# EAGLE design Maduino LoRa Radio v2.1 (EAGLE 6.1)
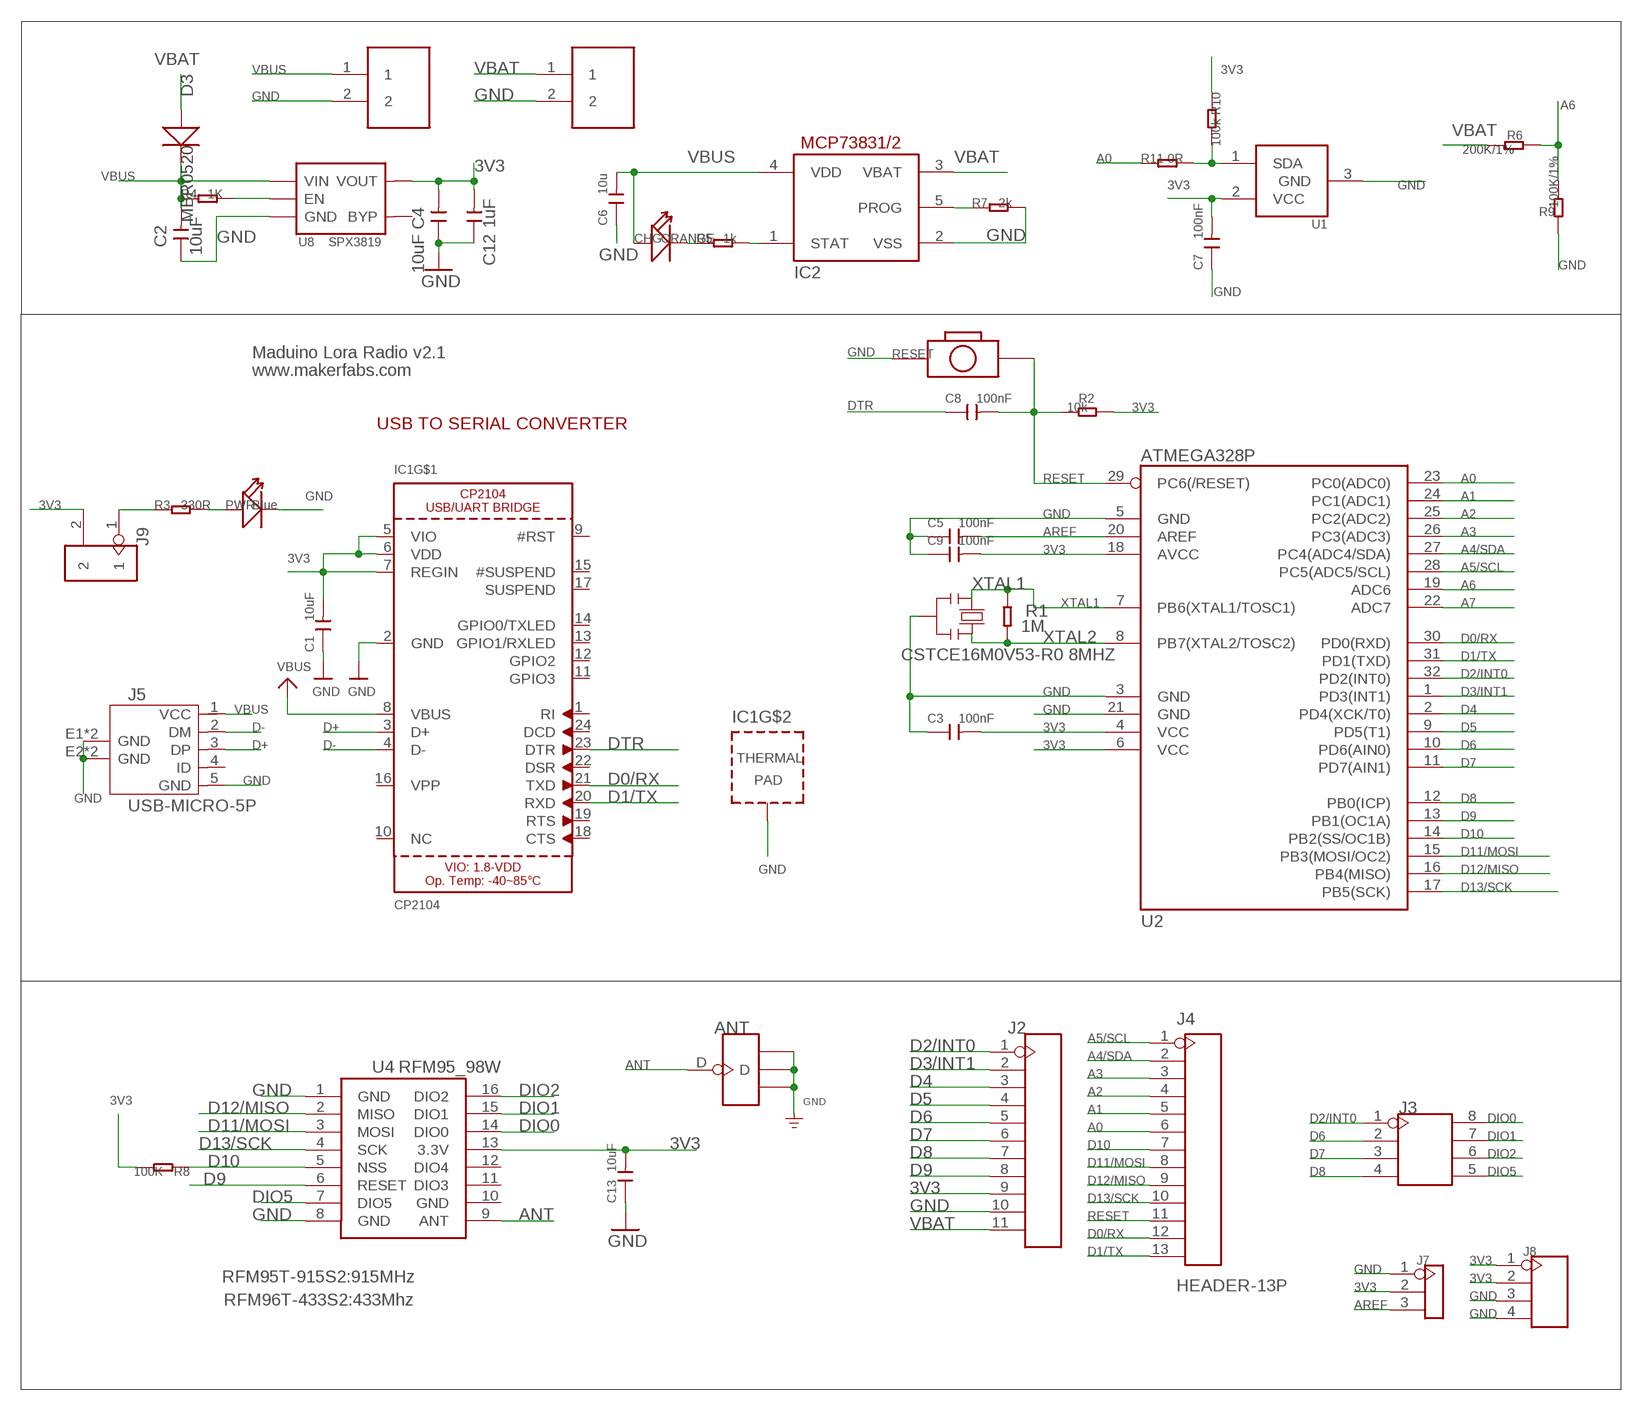
[diagram p0: schematic, sheet 1]

## Parts
ANT  ANTENNA-U-FL  [4P-U-FL]
C1  10uF  C-0603  [0603]
C2  10uF  C-0603  [0603]
C3  100nF  C-0603  [0603]
C4  10uF  C-0603  [0603]
C5  100nF  C-0603  [0603]
C6  10u  C-0603  [0603]
C7  100nF  C-0603  [0603]
C8  100nF  C-0603  [0603]
C9  100nF  C-0603  [0603]
C12  1uF  C-0603  [0603]
C13  10uF  C-0603  [0603]
CHG  ORANGE  007-LED0603  [D0603]
D3  MBR0520  D'1206'  [SOD123]
IC1  CP2104  [QFN24_4MM_SMSC]
IC2  MCP73831/OT  [SOT23-5L]
J1  PH2.0-2P-90-DIP  [PH2.0-2P-90-DIP]
J2  HEADER-11P-2.54  [11P-2.54]
J3  HEADER-2X4P-2.54  [2X4P-2.54]
J4  HEADER-13P  [13P-2.54]
J5  USB-MICRO-5P  [MICRO-USB-5P]
J6  PH2.0-2P-90-DIP  [PH2.0-2P-90-DIP]
J7  HEADER-3P-2.54  [3P-2.54]
J8  HEADER-4P-60/35MILROUND  [4P-65/35ROUND]
J9  HEADER-2P-2.0  [2P-2.0]
PWR  Blue  LED'0603'  [LED-0603]
R1  1M  R-0603  [R0603]
R2  10k  R-0603  [R0603]
R3  330R  R-0603  [R0603]
R4  1K  R-0603  [R0603]
R5  1k  R-0603  [R0603]
R6  200K/1%  R-0603  [R0603]
R7  2k  R-0603  [R0603]
R8  100K  R-0603  [R0603]
R9  100K/1%  R-0603  [R0603]
R10  100k  R-0603  [R0603]
R11  0R  R-0603  [R0603]
RESET  BOTTON-2P-90D  [2P-7.62X3.56-90D]
U1  IC_ATSHA204A_CRYPT  [SOT23-3]
U2  ATMEGA328P  ATMEGA8/168/328  [TQFP32]
U4  RFM95_98W  RFM92_93W  [RFM92_93W]
U8  SPX3819  [SOT23-5]
Y1  CSTCE16M0V53-R0 8MHZ  RESONATORMU  [RESONATOR]

## Nets
3V3: C1.2 C3.2 C4.2 C7.2 C9.2 C12.2 C13.2 IC1.5(VIO) IC1.6(VDD) IC1.7(REGIN) J2.9 J7.2 J8.1 J8.2 J9.2 R2.1 R8.2 R10.1 U1.2(VCC) U2.4(VCC) U2.6(VCC) U2.18(AVCC) U4.13(3.3V) U8.5(VOUT)
A0: J4.6 R11.1 U2.23(PC0(ADC0))
A1: J4.5 U2.24(PC1(ADC1))
A2: J4.4 U2.25(PC2(ADC2))
A3: J4.3 U2.26(PC3(ADC3))
A4/SDA: J4.2 U2.27(PC4(ADC4/SDA))
A5/SCL: J4.1 U2.28(PC5(ADC5/SCL))
A6: R6.1 R9.2 U2.19(ADC6)
A7: U2.22(ADC7)
ANT: ANT.D U4.9(ANT)
AREF: C5.2 J7.3 U2.20(AREF)
D0/RX: IC1.21(TXD) J4.12 U2.30(PD0(RXD))
D1/TX: IC1.20(RXD) J4.13 U2.31(PD1(TXD))
D2/INT0: J2.1 J3.1 U2.32(PD2(INT0))
D3/INT1: J2.2 U2.1(PD3(INT1))
D4: J2.3 U2.2(PD4(XCK/T0))
D5: J2.4 U2.9(PD5(T1))
D6: J2.5 J3.2 U2.10(PD6(AIN0))
D7: J2.6 J3.3 U2.11(PD7(AIN1))
D8: J2.7 J3.4 U2.12(PB0(ICP))
D9: J2.8 U2.13(PB1(OC1A)) U4.6(RESET)
D10: J4.7 R8.1 U2.14(PB2(SS/OC1B)) U4.5(NSS)
D11/MOSI: J4.8 U2.15(PB3(MOSI/OC2)) U4.3(MOSI)
D12/MISO: J4.9 U2.16(PB4(MISO)) U4.2(MISO)
D13/SCK: J4.10 U2.17(PB5(SCK)) U4.4(SCK)
D+: IC1.3(D+) J5.3(DP)
D-: IC1.4(D-) J5.2(DM)
DIO0: J3.8 U4.14(DIO0)
DIO1: J3.7 U4.15(DIO1)
DIO2: J3.6 U4.16(DIO2)
DIO5: J3.5 U4.7(DIO5)
DTR: C8.1 IC1.23(DTR)
GND: ANT.GND1 ANT.GND2 ANT.GND3 C1.1 C2.1 C3.1 C4.1 C5.1 C6.1 C7.1 C9.1 C12.1 C13.1 IC1.2(GND) IC1.THERM(TP) IC2.2(VSS) J1.2 J2.10 J5.5(GND) J5.E1(GND) J5.E2(GND) J5.P1(GND) J5.P2(GND) J6.2 J7.1 J8.3 J8.4 PWR.- R7.2 R9.1 RESET.P$1 U1.3(GND) U2.3(GND) U2.5(GND) U2.21(GND) U4.1(GND) U4.8(GND) U8.2(GND) Y1.2
N$1: J9.1 R3.1
N$2: R10.2 R11.2 U1.1(SDA)
N$7: PWR.+ R3.2
N$24: R4.2 U8.3(EN)
N$25: CHG.- R5.1
N$26: IC2.1(STAT) R5.2
N$31: IC2.5(PROG) R7.1
RESET: C8.2 J4.11 R2.2 RESET.P$2 U2.29(PC6(/RESET))
VBAT: D3.+ IC2.3(VBAT) J2.11 J6.1 R6.2
VBUS: C2.2 C6.2 CHG.+ D3.- IC1.8(VBUS) IC2.4(VDD) J1.1 J5.1(VCC) R4.1 U8.1(VIN)
XTAL1: R1.2 U2.7(PB6(XTAL1/TOSC1)) Y1.1
XTAL2: R1.1 U2.8(PB7(XTAL2/TOSC2)) Y1.3
Unconnected: IC1.1(RI) IC1.9(#RST) IC1.10(NC) IC1.11(GPIO3) IC1.12(GPIO2) IC1.13(GPIO1/RXLED) IC1.14(GPIO0/TXLED) IC1.15(#SUSPEND) IC1.16(VPP) IC1.17(SUSPEND) IC1.18(CTS) IC1.19(RTS) IC1.22(DSR) IC1.24(DCD) J5.4(ID) U4.11(DIO3) U4.12(DIO4) U8.4(BYP)

## Notes on the sheet
- Maduino Lora Radio v2.1
- www.makerfabs.com
- USB TO SERIAL CONVERTER
- RFM95T-915S2:915MHz
- RFM96T-433S2:433Mhz

## Power pins joined to a net without a drawn wire
GND: U4.10(GND)

## Library data of the parts
ANT = Connector:ANTENNA-U-FL
C1-C9 C12 C13 = Discrete:C*: Ceramic Capacitors
CHG = Discrete:007-LED*
D3 = Discrete:D*
IC1 = microbuilder:CP2104: CP2104 - USB to UART Bridge VDD Output: 3.45V
IC2 = adafruit:MCP73831: MCP73831/2 Miniature Single-Cell, Fully Integrated Li-Ion, Li-Polymer Charge Management Controllers. Nice and small simple lipoly charge controller, with adjustable current and status output (LED) http://www.ladyada.net/library/pcb/eaglelibrary.html
J1 J6 = Connector:PH2.0-2P-90-DIP
J2 = Connector:HEADER-11P
J3 = Connector:HEADER-2X4P
J4 = Connector:HEADER-13P
J5 = Connector:USB-MICRO-5P
J7 = Connector:HEADER-3P
J8 = Connector:HEADER-4P
J9 = Connector:HEADER-2P
PWR = Discrete:LED*
R1-R11 = Discrete:R*
RESET = Discrete:BOTTON-2P
U1 = TD-MySensors:IC_ATSHA204A_CRYPT
U2 = IC:ATMEGA8/168/328: MICROCONTROLLER
U4 = dragino:RFM92_93W
U8 = IC:SPX3819
Y1 = SmartPrj:RESONATOR

## Net classes
0 default: width 0.152 mm, drill 0.152 mm, clearance 0.152 mm
2 gnd: width 0.305 mm, drill 0.559 mm, clearance 0.254 mm
3 usbvcc: width 0.508 mm, drill 0.61 mm, clearance 0.254 mm

## Board
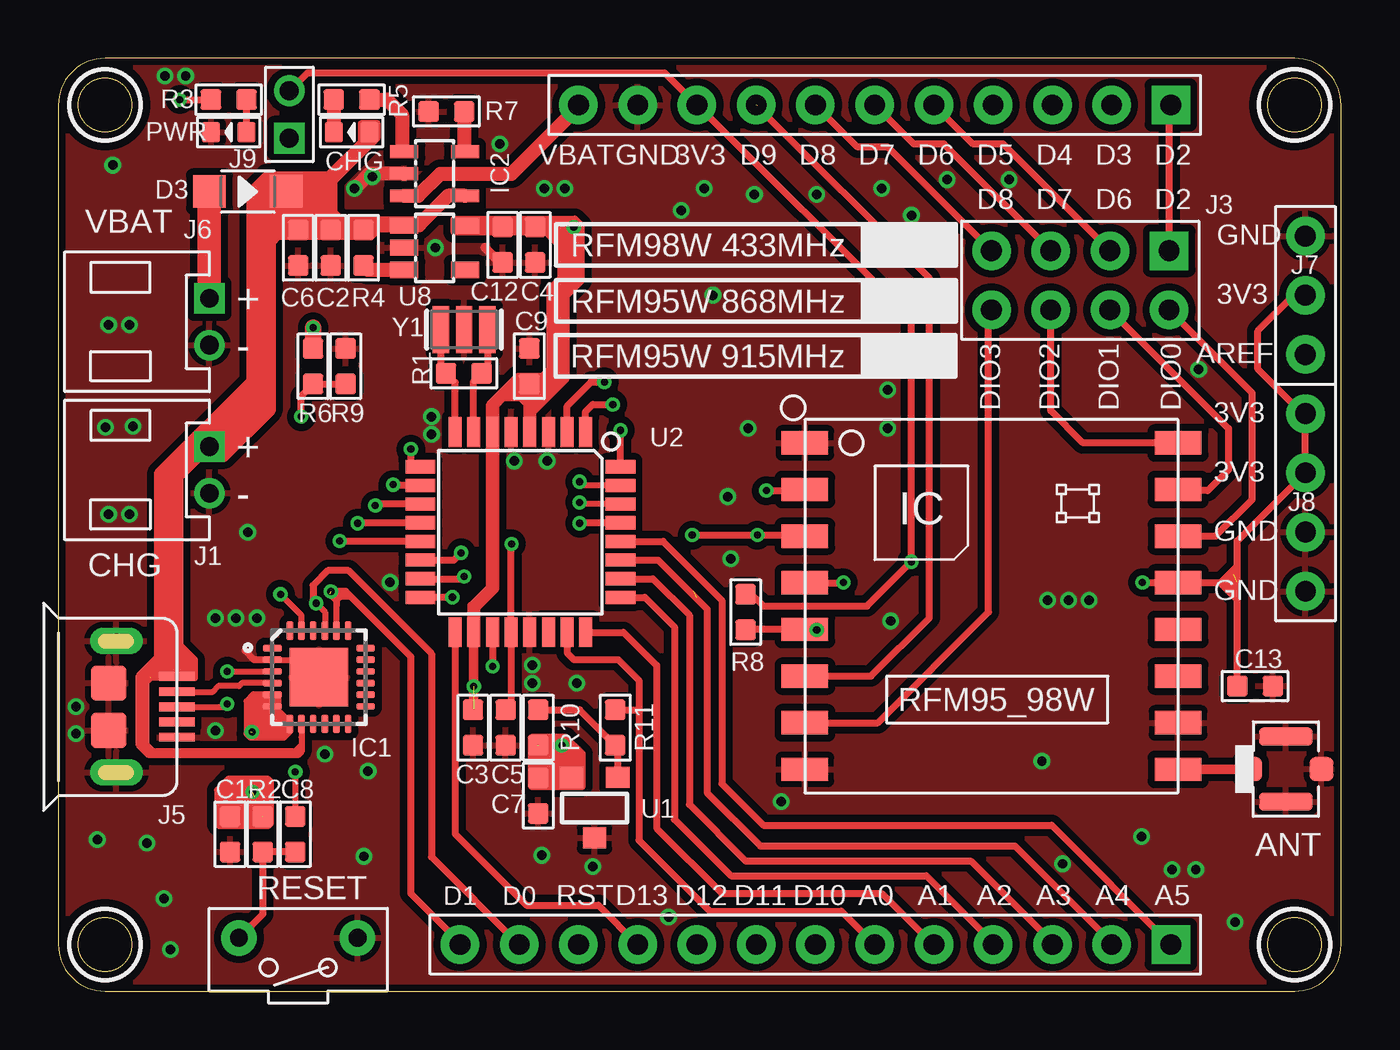
[diagram p1: board, top side]
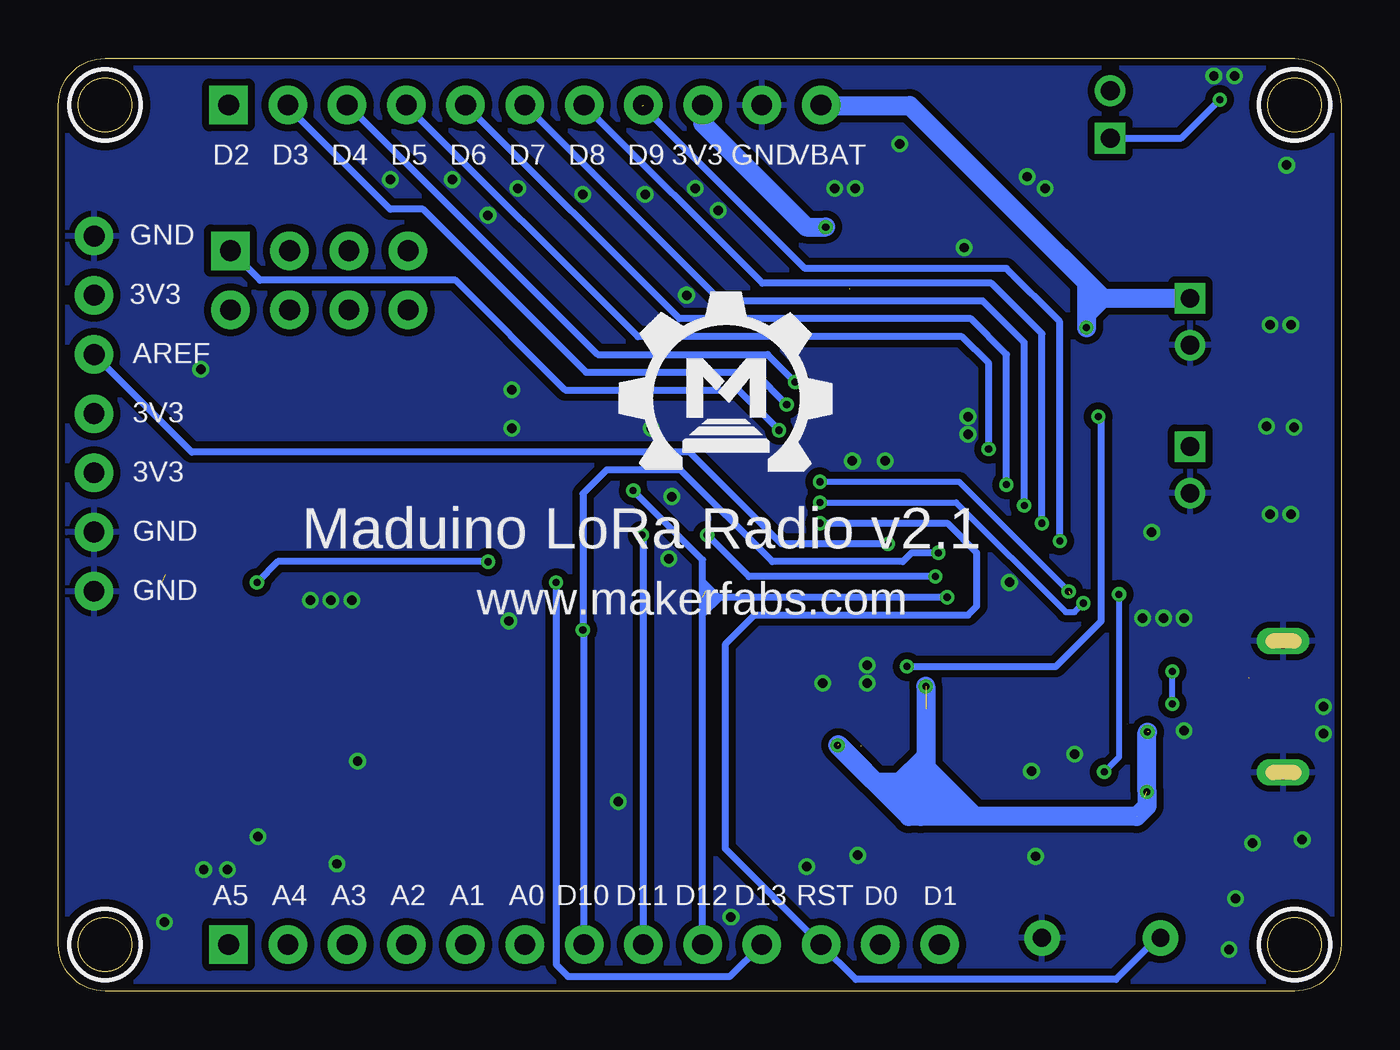
[diagram p2: board, bottom side, seen from below]

Size 55 x 40 mm. Coordinates in mm from the lower left corner, seen from the top.
Outline: 0,38 0,2 arc90 2,0 53,0 arc90 55,2 55,38 arc90 53,40 2,40 arc90 0,38
Outline: circle at 53,2 radius 1.14
Outline: circle at 53,38 radius 1.14
Outline: circle at 2,2 radius 1.14
Outline: circle at 2,38 radius 1.14
Copper layers (1*16): Top 0.035mm / dielectric 1.5mm / Bottom 0.035mm
Design rules: minimum track width 6mil, minimum drill 12mil, track to track 6mil, track to pad 6mil, pad to pad 6mil, via to via 6mil, smd to smd 0mil, copper to edge 10mil, drill to drill 10mil, minimum pad ring 10mil, minimum via ring 6mil, stop-mask expansion 2mil, vias tented up to drill 100mil, thermal gap 10mil
tRestrict: area 51.5,0.5 to 54.5,3.5; area 51.5,36.5 to 54.5,39.5; area 0.5,0.5 to 3.5,3.5; area 0.5,36.5 to 3.5,39.5
bRestrict: area 51.5,0.5 to 54.5,3.5; area 51.5,36.5 to 54.5,39.5; area 0.5,0.5 to 3.5,3.5; area 0.5,36.5 to 3.5,39.5

### Footprints (pad centres in the part's own frame; a part is rotated, then mirrored left to right if it is on the bottom)
4P-U-FL = smd 1.016 x 1.016: D -1.524,0; GND3 1.524,0 | smd 2.286 x 0.762: GND1 0,1.397; GND2 0,-1.397
0603 = smd 0.889 x 0.889: 1 -0.762,0; 2 0.762,0
D0603 = smd 0.762 x 0.889: + -0.762,0; - 0.762,0
SOD123 = smd 1.397 x 1.397: + -1.651,0; - 1.651,0
QFN24_4MM_SMSC = smd 0.8 x 0.28: 1 -2,1.25; 2 -2,0.75; 3 -2,0.25; 4 -2,-0.25; 5 -2,-0.75; 6 -2,-1.25; 13 2,-1.25; 14 2,-0.75; 15 2,-0.25; 16 2,0.25; 17 2,0.75; 18 2,1.25 | smd 0.28 x 0.8: 7 -1.25,-2; 8 -0.75,-2; 9 -0.25,-2; 10 0.25,-2; 11 0.75,-2; 12 1.25,-2; 19 1.25,2; 20 0.75,2; 21 0.25,2; 22 -0.25,2; 23 -0.75,2; 24 -1.25,2 | smd 2.5 x 2.5: THERM 0,0
SOT23-5L = smd 0.55 x 1.2: 1 -0.95,-1.3; 2 0,-1.3; 3 0.95,-1.3; 4 0.95,1.3; 5 -0.95,1.3
PH2.0-2P-90-DIP = drill 0.8 square: 1 0,1 | drill 0.8: 2 0,-1
11P-2.54 = drill 0.889 pad 1.651 square: 1 0,12.7 | drill 0.889 pad 1.651: 2 0,10.16; 3 0,7.62; 4 0,5.08; 5 0,2.54; 6 0,0; 7 0,-2.54; 8 0,-5.08; 9 0,-7.62; 10 0,-10.16; 11 0,-12.7
2X4P-2.54 = drill 0.889 pad 1.651 square: 1 -1.27,3.81 | drill 0.889 pad 1.651: 2 -1.27,1.27; 3 -1.27,-1.27; 4 -1.27,-3.81; 5 1.27,-3.81; 6 1.27,-1.27; 7 1.27,1.27; 8 1.27,3.81
13P-2.54 = drill 0.889 pad 1.651 square: 1 0,15.24 | drill 0.889 pad 1.651: 2 0,12.7; 3 0,10.16; 4 0,7.62; 5 0,5.08; 6 0,2.54; 7 0,0; 8 0,-2.54; 9 0,-5.08; 10 0,-7.62; 11 0,-10.16; 12 0,-12.7; 13 0,-15.24
MICRO-USB-5P = smd 0.38 x 1.52: 1 -1.3,0; 2 -0.65,0; 3 0,0; 4 0.65,0; 5 1.3,0 | smd 1.524 x 1.524: E1 -1.016,-2.921; E2 1.016,-2.921 | drill 0.635 pad 1.143 long: P1 -2.819,-2.591; P2 2.819,-2.591
3P-2.54 = drill 0.9 pad 1.651: 1 0,2.54; 2 0,0; 3 0,-2.54
4P-65/35ROUND = drill 0.889 pad 1.651: 1 0,3.81; 2 0,1.27; 3 0,-1.27; 4 0,-3.81
2P-2.0 = drill 0.813 pad 1.27 square: 1 -1.016,0 | drill 0.813 pad 1.27: 2 1.016,0
LED-0603 = smd 0.762 x 0.889: + -0.762,0; - 0.762,0
R0603 = smd 0.889 x 0.889: 1 -0.762,0; 2 0.762,0
2P-7.62X3.56-90D = drill 0.762 pad 1.524: P$1 0,2.54; P$2 0,-2.54
SOT23-3 = smd 1 x 0.9: 1 -1,-1.3; 2 1,-1.3; 3 0,1.3
TQFP32 = smd 1.27 x 0.559: 1 -4.293,2.8; 2 -4.293,2; 3 -4.293,1.2; 4 -4.293,0.4; 5 -4.293,-0.4; 6 -4.293,-1.2; 7 -4.293,-2; 8 -4.293,-2.8; 17 4.293,-2.8; 18 4.293,-2; 19 4.293,-1.2; 20 4.293,-0.4; 21 4.293,0.4; 22 4.293,1.2; 23 4.293,2; 24 4.293,2.8 | smd 0.559 x 1.27: 9 -2.8,-4.293; 10 -2,-4.293; 11 -1.2,-4.293; 12 -0.4,-4.293; 13 0.4,-4.293; 14 1.2,-4.293; 15 2,-4.293; 16 2.8,-4.293; 25 2.8,4.293; 26 2,4.293; 27 1.2,4.293; 28 0.4,4.293; 29 -0.4,4.293; 30 -1.2,4.293; 31 -2,4.293; 32 -2.8,4.293
RFM92_93W = smd 2 x 1: 1 -8,7; 2 -8,5; 3 -8,3; 4 -8,1; 5 -8,-1; 6 -8,-3; 7 -8,-5; 8 -8,-7; 9 8,-7; 10 8,-5; 11 8,-3; 12 8,-1; 13 8,1; 14 8,3; 15 8,5; 16 8,7
SOT23-5 = smd 0.69 x 1.2: 1 -0.95,-1.3; 2 0,-1.3; 3 0.95,-1.3; 4 0.95,1.3; 5 -0.95,1.3
RESONATOR = smd 0.7 x 2: 1 -1,0; 2 0,0; 3 1,0

### Placement (x,y rotation side)
ANT  52.63,9.53 0 top
C1  7.37,6.73 90 top
C2  11.68,31.88 90 top
C3  17.78,11.3 90 top
C4  20.45,32 90 top
C5  19.18,11.3 90 top
C6  10.29,31.88 90 top
C7  20.57,8.38 90 top
C8  10.16,6.73 270 top
C9  20.19,26.8 270 top
C12  19.05,32 90 top
C13  51.31,13.08 180 top
CHG  12.57,36.83 180 top
D3  8.13,34.29 0 top
IC1  11.18,13.46 0 top
IC2  16.13,35.05 270 top
J1  6.48,22.35 0 top
J2  35,38 270 top
J3  43.81,30.48 270 top
J4  32.46,2 270 top
J5  5.08,12.19 270 top
J6  6.48,28.7 0 top
J7  53.47,29.84 0 top
J8  53.47,20.95 0 top
J9  9.91,37.59 90 top
PWR  7.3,36.83 180 top
R1  17.38,26.49 0 top
R2  8.76,6.73 270 top
R3  7.3,38.23 0 top
R4  13.08,31.88 270 top
R5  12.57,38.23 0 top
R6  10.92,26.8 90 top
R7  16.64,37.72 180 top
R8  29.46,16.26 90 top
R9  12.32,26.8 270 top
R10  20.57,11.3 90 top
R11  23.88,11.3 270 top
RESET  10.29,2.29 270 top
U1  22.99,7.87 180 top
U2  19.81,19.68 270 top
U4  40.01,16.51 0 top
U8  16.13,31.88 270 top
U$1  [MAKERFABS_0.3]  30.49,22.35 0 bottom
Y1  17.4,28.37 180 top

### Tracks (layer width: path | path; a pad name or v marks a point on that pad's centre or on a via)
3V3  (via drill 0.3)  (9 unrouted)
  Top 0.203: 48.01,17.53 U4.13
  Top 0.254: IC1.5 8.52,12.71 8.38,12.57 8.38,12.32 8.49,12.21 IC1.6 9.18,11.53 9.27,11.43 9.89,11.43 IC1.7 9.18,11.46 | C1.2 R2.1 | 9.45,12.65 8.93,12.65 8.86,12.73 8.36,12.73 8.07,12.43 8.07,11.04 8.23,10.87 9.67,10.87 9.94,11.14 9.94,11.52 9.44,12.02 9.45,12.02 9.45,12.7 9.43,12.72 9.43,12.64 9.3,12.52 8.4,12.52 8.26,12.37 8.26,11.11 8.34,11.03 9.55,11.03 9.72,11.2 9.72,11.51 9.23,12 9.23,12.34 9.27,12.38 8.61,12.38 8.46,12.24 8.46,11.26 8.53,11.19 9.41,11.19 9.56,11.33 9.56,11.4 8.9,12.06 8.72,12.06 8.67,12.02 8.67,11.28 8.69,11.26 8.72,11.26 9.01,11.55 9.01,11.7 8.82,11.89 8.82,11.48 8.85,11.46 | 20.84,10.52 20.6,10.52 20.26,10.86 20.26,8.8 20.3,8.76 22.46,8.76 22.49,8.78 22.49,10.19 21.77,10.9 20.29,10.9 20.26,10.87 20.31,10.87 20.48,10.7 | 49.8,17.51 50.53,16.78 | 50.53,16.78 50.53,16.54 | 50.53,16.78 50.53,18.27 50.53,18.24 49.82,17.53 50.08,17.53 50.41,17.86 50.41,17.12 50.42,17.11 50.38,17.11 50.13,17.36
  Top 0.305: v22.1,32.77 21.59,32.77 | 21.59,32.77 21.59,30.61 21.08,30.1 21.08,26.29 20.83,26.04 C9.2 20.21,26.02 20.21,25.45 | 21.59,32.77 C4.2 | 47.99,17.53 U4.13 48.02,17.53 50.55,17.53 | v46.48,17.53 48.01,17.53 | R8.2 29.72,17.02 30.23,16.51 34.67,16.51 v36.58,18.41 36.58,28.83 27.3,38.1 27.3,38.08 J2.9 26.01,39.37 10.67,39.37 J9.2 | J7.2 52.96,29.84 51.44,28.32 51.44,26.67 53.34,24.77 J8.1 J8.2 50.55,19.3 50.55,17.53 | U1.2 20.6,9.17 C7.2 R10.1 v21.59,10.54 | C3.2 17.81,12.1 | C13.2 50.55,17.53 | v8.3,11.11 8.83,11.11 9.18,11.46 | 6.86,7.12 9.02,7.12 9.1,7.2 9.1,8.98 8.99,9.09 7.29,9.09 6.82,8.62 6.82,7.15 6.85,7.12 6.93,7.12 7.12,7.31 | U2.4 20.21,25.45 | U2.6 18.61,25.12 18.97,25.48 20.19,25.48 20.21,25.45 | 18.49,23.47 18.49,25.17 19.69,26.38 20.75,26.38 21.06,26.68 21.06,26.69 21.09,26.72 21.09,30.13 21.55,30.58 21.55,31.91 20.92,32.54 16.98,32.54 16.98,33.1 16.97,33.11 22.15,33.11 22.4,32.85 22.4,30.45 21.76,29.8 21.76,26.24 20.34,24.82 20.34,23.63 20.09,23.88 20.09,25.16 19.82,25.43 19.07,25.43 18.74,25.1 18.74,17.22 17.92,16.4 17.92,15.53 17.93,15.52 17.71,15.52 17.7,15.5 17.7,16.55 18.49,17.34 18.49,24.14 18.66,24.31 18.66,25.16 19.69,26.19 20.86,26.19 20.57,25.9 19.57,25.9 19.36,25.7 19.36,25.71 20.38,25.71 20.41,25.68 20.41,25.11 20.7,25.41 20.7,25.81
  Top 0.4: U2.6 18.61,17.34 17.81,16.54 U2.18 17.81,12.1
  Top 0.61: U8.5 18.86,32.83 19.05,32.64 C12.2 | C12.2 19.18,32.89 19.18,32.77 C12.2 | C12.2 C4.2 | 7.12,7.31 8.01,7.31 8.32,7.62 8.39,7.62 8.82,8.05 8.82,8.71 8.76,8.77 7.47,8.77 7.14,8.44 7.14,8.01 7.16,8 7.3,8 7.62,8.32 8.41,8.32 8.42,8.33 8.42,8.22 8,7.8 7.74,7.8 7.61,7.92 | 20.48,10.7 20.48,9.64 21.07,9.05 21.4,9.05 21.4,9.06 21.4,9.43 20.82,10.01 20.82,10.44 21,10.62 21.57,10.62 21.75,10.45 21.75,10.42 22.18,9.99 22.18,9.65 21.83,9.65 21.17,10.31 | 20.7,25.81 21.27,26.38 21.43,26.38 21.43,30.03 21.97,30.57 21.97,32.77 22,32.8 21.05,32.8 21.01,32.83 21.04,32.83 21.51,32.37 21.61,32.37 21.93,32.04
  Bottom 0.305: v36.58,18.41 45.59,18.41 v46.48,17.53
  Bottom 0.813: J2.9 27.38,37.21 22.93,32.76 v22.1,32.76 v22.1,32.77 | v8.3,11.11 8.33,11.09 v8.33,8.55 8.33,7.93 R2.1 18.03,7.49 | 18.03,7.49 18.54,7.49 v21.59,10.54 | v17.81,13.07 17.81,7.71 18.03,7.49 | 19.57,8.84 17.83,8.84 17.35,8.84 16.02,7.51 16.82,7.51 17.37,8.06 18.47,8.06 18.67,8.25 19.23,8.25 21.55,10.57 21.55,10.54 19.98,8.96 18.91,8.96 17.9,9.98 17.9,9.69 15.74,7.53
A0
  Top 0.305: J4.6 33.57,3.43 27.94,3.43 24.89,6.48 24.89,12.06 | 24.89,12.06 24.89,13.34 24,14.22 22.1,14.22 21.81,14.51 U2.23 | R11.1 24.89,12.06
A1
  Top 0.305: U2.24 24.23,15.39 25.65,13.97 25.65,6.99 28.45,4.19 35.31,4.19 37.47,2.03 37.57,2.03 | 37.59,2.03 37.57,2.03 | 37.57,2.03 J4.5
A2
  Top 0.305: J4.4 40.11,2.03 40.13,2.03 37.21,4.95 28.83,4.95 26.42,7.37 26.42,15.62 25.15,16.89 U2.25
A3
  Top 0.305: U2.26 25.5,17.68 27.05,16.13 27.05,8 29.46,5.59 39.12,5.59 42.67,2.03 42.64,2 J4.3
A4/SDA
  Top 0.305: U2.27 25.71,18.48 27.81,16.38 27.81,8.51 30.1,6.22 41.02,6.22 45.21,2.03 45.19,2.03 J4.2
A5/SCL
  Top 0.305: J4.1 42.59,7.11 30.23,7.11 28.45,8.89 28.45,16.76 25.93,19.29 U2.28
A6  (via drill 0.3)
  Top 0.305: R9.2 R6.1 10.41,25.53 v10.41,24.64 | U2.19 v18.61,13.91 v18.61,13.92
  Bottom 0.305: v10.41,24.64 10.29,24.51 10.29,15.88 12.24,13.92 v18.61,13.92
ANT
  Top 0.203: 51.05,9.53 ANT.D
  Top 0.406: U4.9 51.04,9.51 51.05,9.53
AREF  (via drill 0.3)
  Top 0.305: v19.43,19.18 19.41,19.16 U2.20 19.41,12.08 19.2,12.08 C5.2 19.3,12.06
  Bottom 0.305: J7.3 49.28,23.11 27.94,23.11 24,19.18 v19.43,19.18
D0/RX  (via drill 0.3)
  Top 0.254: U2.30 22.42,20.89 v22.35,20.95 | v11.05,16.64 11.43,16.26 IC1.21
  Top 0.305: v11.05,16.64 10.92,16.76 10.92,17.4 11.56,18.03 12.45,18.03 16,14.48 16,5.76 J4.12
  Bottom 0.254: v11.05,16.64 11.43,16.26 11.81,16.26 16.51,20.95 v22.35,20.95
D1/TX  (via drill 0.3)  (1 unrouted)
  Top 0.203: 17.27,2.03 17.22,2.03 J4.13
  Top 0.254: U2.31 22.51,21.68 v22.35,21.84 | IC1.20 11.93,17.14 v11.68,17.14 | 11.92,16.75 12.1,16.93 | 12.1,16.93 12.52,16.93 | 12.1,16.93 11.92,16.93 11.93,16.93 11.93,16.86 | 11.93,16.74 11.93,16.5 11.93,16.86 | 11.93,16.86 11.93,16.74 | 11.93,16.74 11.63,17.03 11.57,17.03 11.6,17.06 11.6,17.07
  Top 0.305: v11.68,17.14 12.32,17.14 15.11,14.35 15.11,4.19 17.27,2.03
  Bottom 0.254: v11.68,17.14 16.38,21.84 v22.35,21.84
D2/INT0  (via drill 0.3)
  Top 0.305: J3.1 47.62,37.92 J2.1 | U2.32 v24.11,24.05 v24.1,24.05
  Bottom 0.305: J3.1 46.35,30.48 37.97,30.48 33.27,25.78 25.83,25.78 v24.1,24.05
D3/INT1  (via drill 0.3)
  Top 0.305: U2.1 22.61,24.86 22.91,25.15 v23.77,25.15 v23.77,25.16
  Bottom 0.305: J2.2 45.19,37.97 45.21,37.97 40.77,33.53 39.37,33.53 32.38,26.54 25.16,26.54 v23.77,25.16
D4  (via drill 0.3)
  Top 0.305: U2.2 21.81,25.1 22.84,26.12 v23.41,26.12
  Bottom 0.305: J2.3 42.57,38 31.88,27.3 24.6,27.3 v23.41,26.12
D5  (via drill 0.3)
  Top 0.305: v15.11,23.24 15.11,22.61 15.39,22.61 U2.9 15.23,22.48 15.11,22.61
  Bottom 0.305: v15.11,23.24 15.11,26.92 16.26,28.07 30.15,28.07 J2.4
D6  (via drill 0.3)
  Top 0.305: 15.37,21.59 15.49,21.72 15.52,21.69 U2.10 14.38,21.68 v14.35,21.72 | J2.5 39.22,36.32 40.51,36.32 J3.2
  Bottom 0.305: v14.35,21.72 14.35,27.3 15.88,28.83 28.37,28.83 J2.5
D7  (via drill 0.3)
  Top 0.305: U2.11 13.65,20.89 v13.59,20.83 | J3.3 37.97,36.32 36.68,36.32 J2.6
  Bottom 0.305: v13.59,20.83 13.59,27.81 15.37,29.59 26.59,29.59 J2.6
D8  (via drill 0.3)
  Top 0.305: U2.12 12.85,20.09 v12.83,20.07 | J3.4 35.56,36.2 34.27,36.2 J2.7
  Bottom 0.305: v12.83,20.07 12.83,28.19 14.99,30.35 24.81,30.35 J2.7
D9  (via drill 0.3)  (1 unrouted)
  Top 0.305: U2.13 12.08,19.29 v12.06,19.3 | U4.6 34.85,13.51 37.34,16 37.34,30.58 J2.8
  Bottom 0.305: v12.06,19.3 12.06,28.7 14.35,30.99 22.99,30.99 29.97,37.97
D10  (via drill 0.3)
  Top 0.305: v32.51,15.49 32.02,15.49 U4.5 29.48,15.51 R8.1 | U2.14 16.96,18.48 v17.27,18.8
  Bottom 0.305: J4.7 32.46,15.44 v32.51,15.49 32.51,21.34 31.5,22.35 28.32,22.35 24.38,18.41 18.8,18.41 18.41,18.8 v17.27,18.8
D11/MOSI  (via drill 0.3)
  Top 0.305: U2.15 17.3,17.68 v17.4,17.78 | v27.18,19.56 v29.97,19.56 31.88,19.56 | 31.88,19.56 32,19.56 | U4.3 31.93,19.51 31.88,19.56
  Bottom 0.305: J4.8 29.92,19.51 v29.97,19.56 | 27.18,19.43 v27.18,19.56 25.4,17.78 v17.4,17.78
D12/MISO  (via drill 0.3)  (1 unrouted)
  Top 0.305: v16.89,16.89 U2.16 | v30.35,21.46 31.96,21.46 U4.2
  Bottom 0.254: 26.43,16.89 26.62,16.89 27.35,16.16 27.35,17.53 27.35,17.54 27.34,17.54 26.68,16.88 26.95,16.88 27.23,17.17 27.23,16.49 27.22,16.49 26.99,16.72 26.99,16.73
  Bottom 0.305: v30.35,21.46 27.38,18.49 27.38,16.89 | J4.9 27.38,16.89 | v16.89,16.89 27.38,16.89
D13/SCK  (via drill 0.3)
  Top 0.305: U4.4 33.64,17.51 v33.66,17.53 | U2.17 17.01,6.74 20.07,3.68 23.16,3.68 J4.10
  Bottom 0.305: v33.66,17.53 33.66,1.14 33.15,0.64 26.2,0.64 J4.10
D+  (via drill 0.3)
  Top 0.254: J5.3 7.11,12.19 v7.24,12.32 | v7.24,13.72 IC1.3
  Bottom 0.254: v7.24,12.32 v7.24,13.72
D-
  Top 0.254: J5.2 6.62,12.84 6.86,13.08 7.75,13.08 7.88,13.21 IC1.4
DIO0
  Top 0.305: U4.14 49.61,19.51 51.18,21.08 51.18,25.65 J3.8
DIO1
  Top 0.305: U4.15 48.05,21.46 49.28,21.46 50.16,22.35 50.16,24.13 J3.7
DIO2
  Top 0.305: U4.16 43.93,23.51 42.55,24.89 J3.6
DIO5
  Top 0.305: U4.7 35.13,11.51 39.88,16.26 39.88,29.08 J3.5
DTR  (via drill 0.3)
  Top 0.254: IC1.23 10.43,16.12 v9.53,17.02 | v10.16,9.4 C8.1
  Bottom 0.254: v9.53,17.02 9.53,10.03 v10.16,9.4
GND  (via drill 0.41)
  Top 0.254: IC1.2 10.43,14.21 IC1.THERM
  Top 0.305: IC1.2 8.39,14.21 8,14.61
  Top 0.406: C12.1 18.92,31.24 18.29,31.88
  Top 0.61: IC2.2 13.34,35.05 12.83,34.54
  other vias: 3.8,6.35 6.73,11.18 0.76,11.05 0.76,12.19 18.92,36.32 13.46,34.92 3.05,28.57 2.16,28.57 22.23,13.21 2.03,24.18 3.19,24.23 16.17,31.88 2.33,35.42 47.75,5.21 48.77,5.21 3.05,20.45 2.16,20.45 5.46,39.24 4.57,39.24 8.51,16 7.62,16 6.73,16 8.12,19.68 21.72,34.42 20.83,34.42 36.58,33.27 35.31,34.42 32.51,34.16 29.84,34.16 27.69,34.42 44.2,16.76 43.31,16.76 42.42,16.76 48.9,26.67 30.99,8.13 29.58,24.14 14.22,17.53 35.56,24.13 35.56,25.78 26.71,33.48 28.07,29.84 28.83,18.54 28.7,21.21 35.69,15.88 43.05,5.46 38.1,34.8 40.77,34.8 13.28,9.44 16,23.88 16,24.64 12.7,34.42 11.43,10.16 20.32,13.21 20.32,13.97 20.95,22.73 19.56,22.73 22.91,5.34 20.72,5.83 26.16,3.17 13.1,5.78 46.45,6.62 42.17,9.86 50.44,2.97 1.67,6.51 4.8,1.78 4.54,3.98
  pour Bottom (isolate 0.305): -1.27,-1.27 60,-1.27 60,45 -1.27,45
  pour Top (isolate 0.305): -1.27,-1.27 60,-1.27 60,45 -1.27,45
N$1  (via drill 0.3)
  Top 0.305: v5.21,38.23 R3.1
  Bottom 0.305: J9.1 6.86,36.58 v5.21,38.23
N$2
  Top 0.305: R10.2 22.35,12.06 R11.2 23.99,10.43 U1.1
N$7
  Top 0.305: PWR.+ R3.2
N$24
  Top 0.61: U8.3 13.27,30.93 R4.2
N$25
  Top 0.61: R5.1 CHG.-
N$26
  Top 0.406: IC2.1 14.73,36.1
  Top 0.61: R5.2 14.1,38.23 14.73,37.59 14.73,36.1
N$31
  Top 0.61: R7.1 17.4,36.03 IC2.5
RESET  (via drill 0.3)
  Top 0.305: U2.29 22.37,20.09 v22.35,20.07 | C8.2 R2.2 8.76,3.3 RESET.P$2
  Bottom 0.305: v22.35,20.07 16.89,20.07 15.62,18.8 15.62,16.51 16,16.13 25.15,16.13 26.42,14.86 26.42,6.12 J4.11 | J4.11 22.26,2 | RESET.P$2 7.87,2.29 9.65,0.51 20.81,0.51 J4.11 | 22.23,2.03 22.27,2.03 J4.11
VBAT  (via drill 0.3)
  Top 0.61: IC2.3 15.43,34.1 16.38,35.05 19.43,35.05 22.3,37.92 | J2.11 22.3,37.92 | 22.3,37.92 22.35,37.97
  Top 0.7: R6.2 v10.92,28.45
  Top 1.016: J6.1 D3.+
  Bottom 0.254: 12.25,31.73 11.85,31.73 10.11,29.99 10.11,29.44 10.68,28.87 10.84,28.87 10.46,29.25 10.46,29.29 10.45,29.29 10.45,30.18 10.51,30.23 10.57,30.23
  Bottom 0.61: 22.27,37.97 J2.11
  Bottom 0.813: 22.27,37.97 18.49,37.97 12.25,31.73 10.92,30.4 10.92,29.47 | 10.92,29.47 v10.92,28.45 | J6.1 10.69,29.7 10.92,29.47
VBUS  (1 unrouted)
  Top 0.254: IC1.8 10.43,10.55 10.16,10.29 4.06,10.29 3.68,10.67 3.68,13.21 3.94,13.46 4.95,13.46 5.08,13.59 | 10.43,10.9 10.43,10.27 10.28,10.12 3.88,10.12 3.46,10.55 3.46,13.54 4.24,14.32 4.24,22.26 8.2,26.21 8.2,34.33 8.9,35.03 11.57,35.03 12.97,36.44 12.97,37.2 13.01,37.24 13.66,37.24 13.68,37.21 13.68,36.57 11.81,34.71 11.81,33.42 12.14,33.09 | 12.21,33.02 12.14,33.09 | 12.14,33.09 15.41,33.09 15.65,32.85 15.65,32.81 15.5,32.66 13.74,32.66 13.4,32.32 9.44,32.32 9.18,32.06 9.18,24.86 7.14,22.82 6.04,22.82 5.22,22 5.22,14.85 5.85,14.21 5.85,13.43 3.96,13.43 3.76,13.23 3.76,10.53 3.88,10.41 3.77,10.41 3.64,10.54 3.64,13.47 3.82,13.65
  Top 0.305: CHG.+ 13.34,36.45 11.56,34.67 9.91,34.67 9.78,34.54 D3.-
  Top 0.406: J5.1 5.08,13.59 5.08,21.95 J1.1
  Top 0.61: IC2.4 16.7,34.1 15.43,32.83 U8.1 13.27,32.83 R4.1 C2.2 C6.2 9.78,32.64 | J1.1 6.71,23.35 8.89,25.53 8.89,32.13 9.4,32.64 9.78,32.64 | D3.- 9.78,32.64 | 3.82,13.65 4.08,13.65 4.38,13.95 5.43,13.95 5.54,13.84 5.54,14.02 5.16,14.4 4.6,14.4 4.58,14.37 4.58,22.03 8.33,25.78 8.33,25.62 8.86,25.09 8.86,25.04 7,23.18 6.33,23.18 6.3,23.21 6.3,23.85 8.33,25.88 8.35,25.88 8.45,25.99 8.45,34.06 9.11,34.72 11.4,34.72 11.48,34.8 11.48,33.3 11.95,32.83 12.81,32.83 12.87,32.78 11.37,32.78 11.06,33.09 9.4,33.09 8.88,32.57 8.88,33.94 9.04,34.1 9.04,33.77 9.32,33.49 11,33.49 11.01,33.51 11.01,34.36 11.03,34.38 10.54,34.38 10.47,34.3 10.47,33.97 10.54,33.9
XTAL1
  Top 0.305: U2.7 17.81,26.16 R1.2 18.4,26.75 Y1.1
XTAL2
  Top 0.305: U2.8 17.01,26.1 R1.1 16.4,26.72 Y1.3

### Text on the board
tPlace: VBAT | GND | 3V3 | D9 | D8 | D7 | D6 | D5 | D4 | D3 | D2 | D8 | D7 | D6 | D2 | VBAT | GND | RFM98W 433MHz | + | RFM95W 868MHz | 3V3 | - | RFM95W 915MHz | AREF | DIO3 | DIO2 | DIO1 | DIO0 | 3V3 | + | 3V3 | - | GND | CHG | GND | D1 | D0 | RST | D13 | D12 | D11 | D10 | A0 | A1 | A2 | A3 | A4 | A5
bPlace: VBAT | GND | 3V3 | D9 | D8 | D7 | D6 | D5 | D4 | D3 | D2 | GND | 3V3 | AREF | 3V3 | 3V3 | Maduino LoRa Radio v2.1 | GND | GND | www.makerfabs.com | D1 | D0 | RST | D13 | D12 | D11 | D10 | A0 | A1 | A2 | A3 | A4 | A5